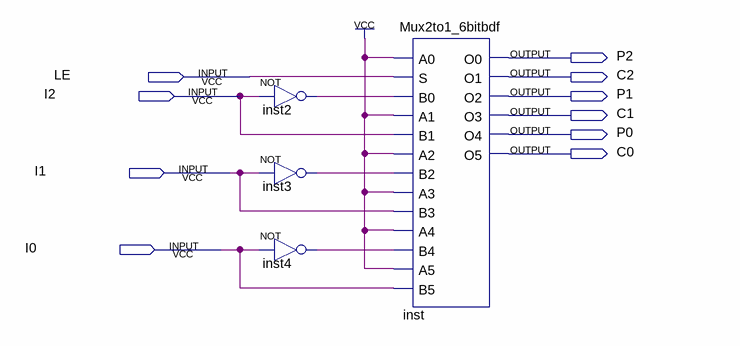
[diagram p0: schematic sheet]
// Quartus schematic Load_Enable_Signal_and_Value.bdf as structural Verilog: 4 symbols, 10 pins
module Load_Enable_Signal_and_Value (
  input  LE,
  input  I2,
  input  I1,
  input  I0,
  output P2,
  output C2,
  output P1,
  output C1,
  output P0,
  output C0
);

  wire inst2_out, inst3_out, inst4_out;

  not inst2 (inst2_out, I2);
  not inst3 (inst3_out, I1);
  not inst4 (inst4_out, I0);
  Mux2to1_6bitbdf inst (
    .A0(1'b1), .S(LE), .B0(inst2_out), .A1(1'b1), .B1(I2), .A2(1'b1), .B2(inst3_out), .A3(1'b1), .B3(I1),
    .A4(1'b1), .B4(inst4_out), .A5(1'b1), .B5(I0), .O0(P2), .O1(C2), .O2(P1), .O3(C1), .O4(P0), .O5(C0));
endmodule
